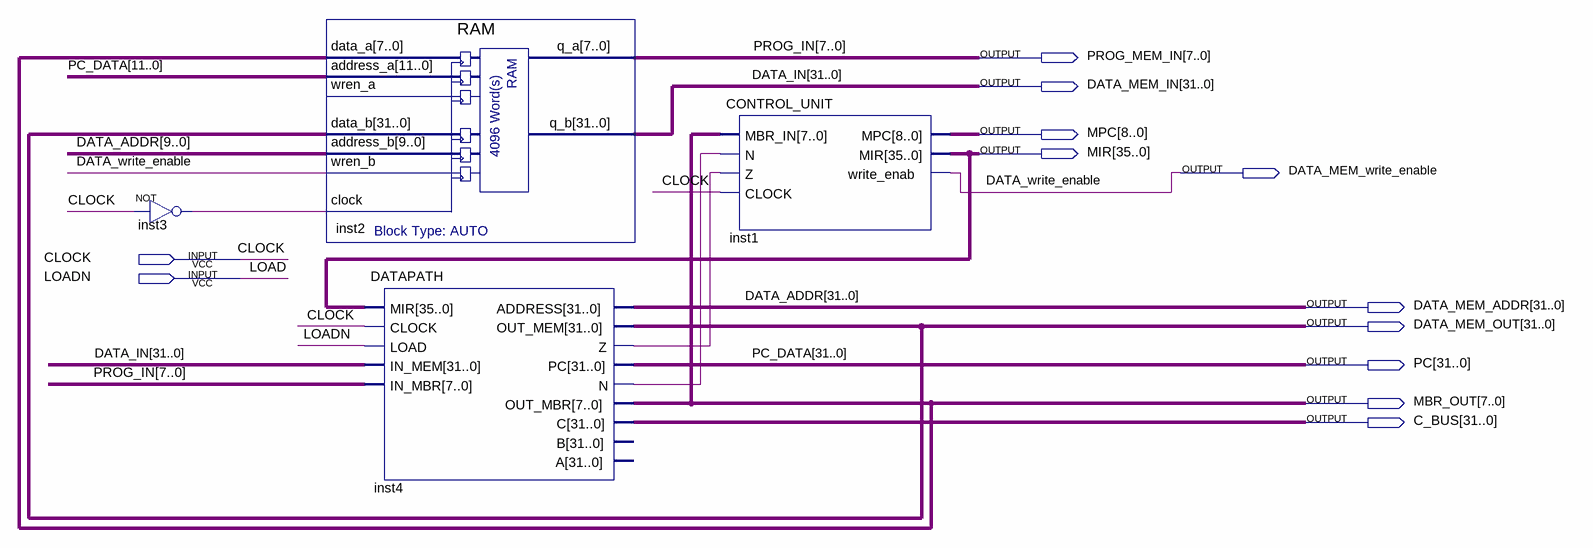
[diagram p0: schematic sheet]
// Quartus schematic mic1.bdf as structural Verilog: 4 symbols, 12 pins
module mic1 (
  input  CLOCK,
  input  LOADN,
  output [7:0] PROG_MEM_IN,
  output [31:0] DATA_MEM_IN,
  output [8:0] MPC,
  output [35:0] MIR,
  output DATA_MEM_write_enable,
  output [31:0] DATA_MEM_ADDR,
  output [31:0] DATA_MEM_OUT,
  output [31:0] PC,
  output [7:0] MBR_OUT,
  output [31:0] C_BUS
);

  wire inst3_out, inst4_n, inst4_z;

  not inst3 (inst3_out, CLOCK);
  RAM inst2 (
    .data_a(MBR_OUT), .address_a(PC[11:0]), .data_b(DATA_MEM_OUT), .address_b(DATA_MEM_ADDR[9:0]),
    .wren_b(DATA_MEM_write_enable), .clock(inst3_out), .q_a(PROG_MEM_IN), .q_b(DATA_MEM_IN));  // open: wren_a
  DATAPATH inst4 (
    .MIR(MIR), .CLOCK(CLOCK), .LOAD(LOADN), .IN_MEM(DATA_MEM_IN), .IN_MBR(PROG_MEM_IN),
    .ADDRESS(DATA_MEM_ADDR), .OUT_MEM(DATA_MEM_OUT), .Z(inst4_z), .PC(PC), .N(inst4_n), .OUT_MBR(MBR_OUT),
    .C(C_BUS));  // open: B, A
  CONTROL_UNIT inst1 (
    .MBR_IN(MBR_OUT), .N(inst4_n), .Z(inst4_z), .CLOCK(CLOCK), .MPC(MPC), .MIR(MIR),
    .write_enab(DATA_MEM_write_enable));

  // Other names for the same wires on the sheet: DATA_ADDR[31:0] = DATA_MEM_ADDR; DATA_IN[31:0] = DATA_MEM_IN;
  //   DATA_write_enable = DATA_MEM_write_enable; LOAD = LOADN; PC_DATA[31:0] = PC; PROG_IN[7:0] = PROG_MEM_IN
endmodule
